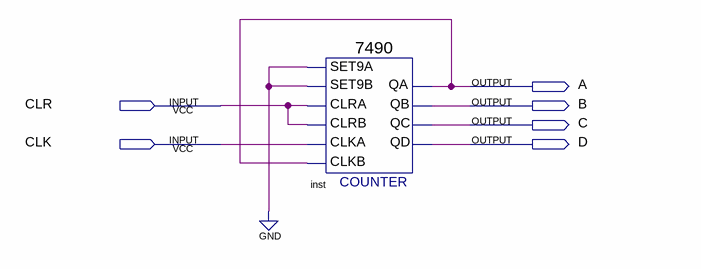
[diagram p0: schematic sheet]
// Quartus schematic CPLD_BCD.bdf as structural Verilog: 1 symbols, 6 pins
module CPLD_BCD (
  input  CLR,
  input  CLK,
  output A,
  output B,
  output C,
  output D
);

  \7490  inst (
    .SET9A(1'b0), .CLRA(CLR), .SET9B(1'b0), .CLKB(A), .CLKA(CLK), .CLRB(CLR), .QD(D), .QA(A), .QB(B), .QC(C));
endmodule
